# EAGLE design soundReactiveDotStarV1 (EAGLE 9.2.0)
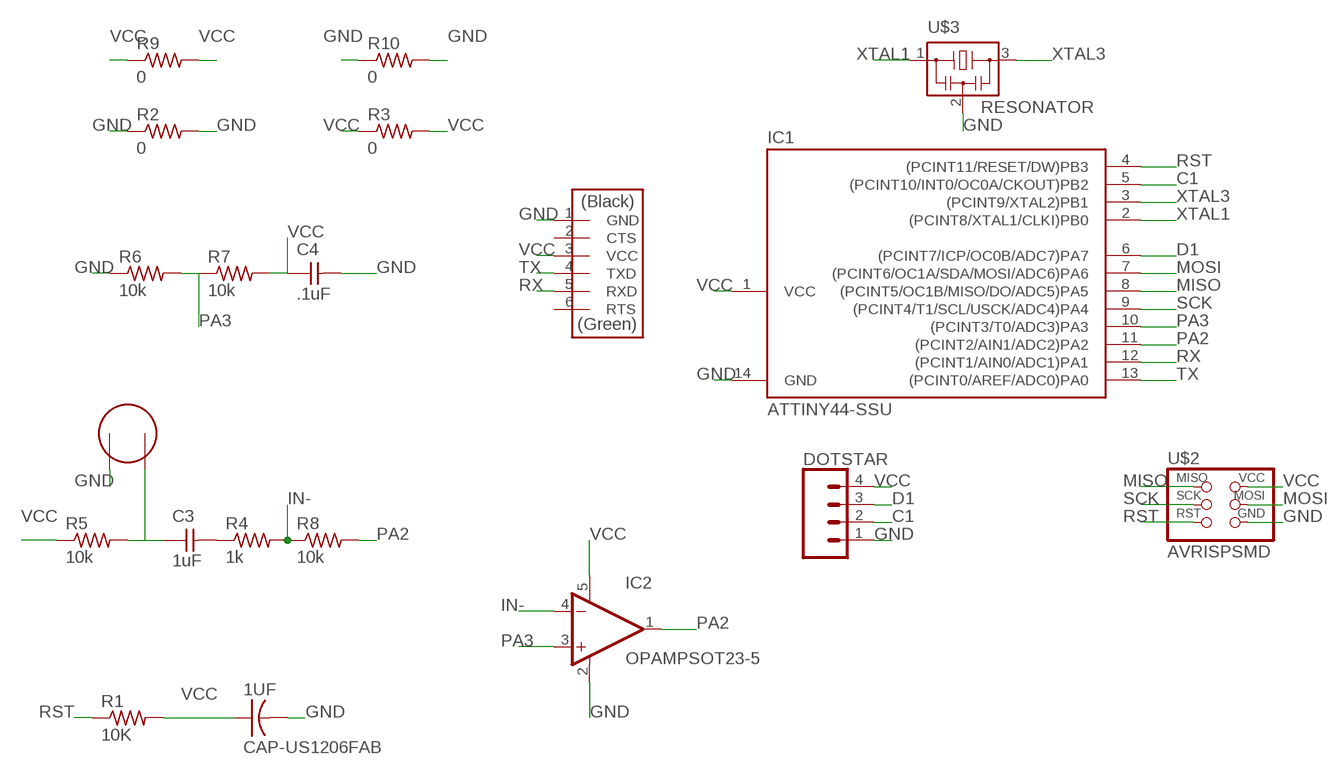
[diagram p0: schematic, sheet 1]

## Parts
1UF  CAP-US1206FAB  [C1206FAB]
C3  1uF  CAP-UNPOLARIZEDFAB  [C1206FAB]
C4  .1uF  CAP-UNPOLARIZEDFAB  [C1206FAB]
DOTSTAR  CONN_04SMD_RA_FEMALE  [1X04_SMD_RA_FEMALE]
IC1  ATTINY44-SSU  [SOIC14]
IC2  OPAMPSOT23-5  [SOT23-5]
R1  10K  RES-US1206FAB  [R1206FAB]
R2  0  RES-US1206FAB  [R1206FAB]
R3  0  RES-US1206FAB  [R1206FAB]
R4  1k  RES-US1206FAB  [R1206FAB]
R5  10k  RES-US1206FAB  [R1206FAB]
R6  10k  RES-US1206FAB  [R1206FAB]
R7  10k  RES-US1206FAB  [R1206FAB]
R8  10k  RES-US1206FAB  [R1206FAB]
R9  0  RES-US1206FAB  [R1206FAB]
R10  0  RES-US1206FAB  [R1206FAB]
U$1  FTDI-SMD-HEADER  [1X06SMD]
U$2  AVRISPSMD  [2X03SMD]
U$3  RESONATOR  [EFOBM]
U$4  ELECTRET  [ELECTRET_2742PBJ-A]

## Nets
C1: DOTSTAR.2 IC1.5((PCINT10/INT0/OC0A/CKOUT)PB2)
D1: DOTSTAR.3 IC1.6((PCINT7/ICP/OC0B/ADC7)PA7)
GND: 1UF.2 C4.2 DOTSTAR.1 IC1.14(GND) IC2.2(V-) R2.1 R2.2 R6.1 R10.1 R10.2 U$1.1(GND) U$2.6(GND) U$3.2 U$4.P$1
IN-: IC2.4(-IN) R4.2 R8.1
MISO: IC1.8((PCINT5/OC1B/MISO/DO/ADC5)PA5) U$2.1(MISO)
MOSI: IC1.7((PCINT6/OC1A/SDA/MOSI/ADC6)PA6) U$2.4(MOSI)
N$1: C3.1 R5.2 U$4.P$2
N$5: C3.2 R4.1
PA2: IC1.11((PCINT2/AIN1/ADC2)PA2) IC2.1(OUT) R8.2
PA3: IC1.10((PCINT3/T0/ADC3)PA3) IC2.3(+IN) R6.2 R7.1
RST: IC1.4((PCINT11/RESET/DW)PB3) R1.1 U$2.5(RST)
RX: IC1.12((PCINT1/AIN0/ADC1)PA1) U$1.5(RXD)
SCK: IC1.9((PCINT4/T1/SCL/USCK/ADC4)PA4) U$2.3(SCK)
TX: IC1.13((PCINT0/AREF/ADC0)PA0) U$1.4(TXD)
VCC: 1UF.1 C4.1 DOTSTAR.4 IC1.1(VCC) IC2.5(V+) R1.2 R3.1 R3.2 R5.1 R7.2 R9.1 R9.2 U$1.3(VCC) U$2.2(VCC)
XTAL1: IC1.2((PCINT8/XTAL1/CLKI)PB0) U$3.1
XTAL3: IC1.3((PCINT9/XTAL2)PB1) U$3.3
Unconnected: U$1.2(CTS) U$1.6(RTS)

## Library data of the parts
1UF = fab:CAP-US
C3 C4 = fab:CAP-UNPOLARIZED
DOTSTAR = SparkFun-Connectors:CONN_04: Multi connection point. Often used as Generic Header-pin footprint for 0.1 inch spaced/style header connections On any of the 0.1 inch spaced packages, you can populate with these: Break Away Headers - Straight <https://www.sparkfun.com/products/116> (PRT-00116) Break Away Male Headers - Right Angle <https://www.sparkfun.com/products/553> (PRT-00553) Female Headers <https://www.sparkfun.com/products/115> (PRT-00115) Break Away Headers - Machine Pin <https://www.sparkfun.com/products/117> (PRT-00117) Break Away Female Headers - Swiss Machine Pin <https://www.sparkfun.com/products/743> (PRT-00743) For SCREWTERMINALS and SPRING TERMINALS visit here: Screw Terimnals on SparkFun.com <https://www.sparkfun.com/search/results?term=Screw+Terminals> (5mm/3.5mm/2.54mm spacing) This device is also useful as a general connection point to wire up your design to another part of your project. Our various solder wires solder well into these plated through hole pads. Hook-Up Wire - Assortment (Stranded, 22 AWG) <https://www.sparkfun.com/products/11375> (PRT-11375) Hook-Up Wire - Assortment (Solid Core, 22 AWG) <https://www.sparkfun.com/products/11367> (PRT-11367) View the entire wire category on our website here <https://www.sparkfun.com/categories/141> Special notes: Molex polarized connector foot print use with SKU : PRT-08231 with associated crimp pins and housings. 1MM SMD Version SKU: PRT-10208; PROD_ID: CONN-12382
IC1 = fab:ATTINY44
IC2 = fab:OPAMP: Rail-to-Rail Operational Amplifiers Single-Supply, MicroAmplifier(TM) Series
R1-R10 = fab:RES-US: Resistor (US Symbol) Variants with postfix FAB are widened to allow the routing of internal traces
U$1 = fab:FTDI-SMD-HEADER
U$2 = fab:AVRISP
U$3 = fab:RESONATOR
U$4 = fab:ELECTRET

## Board
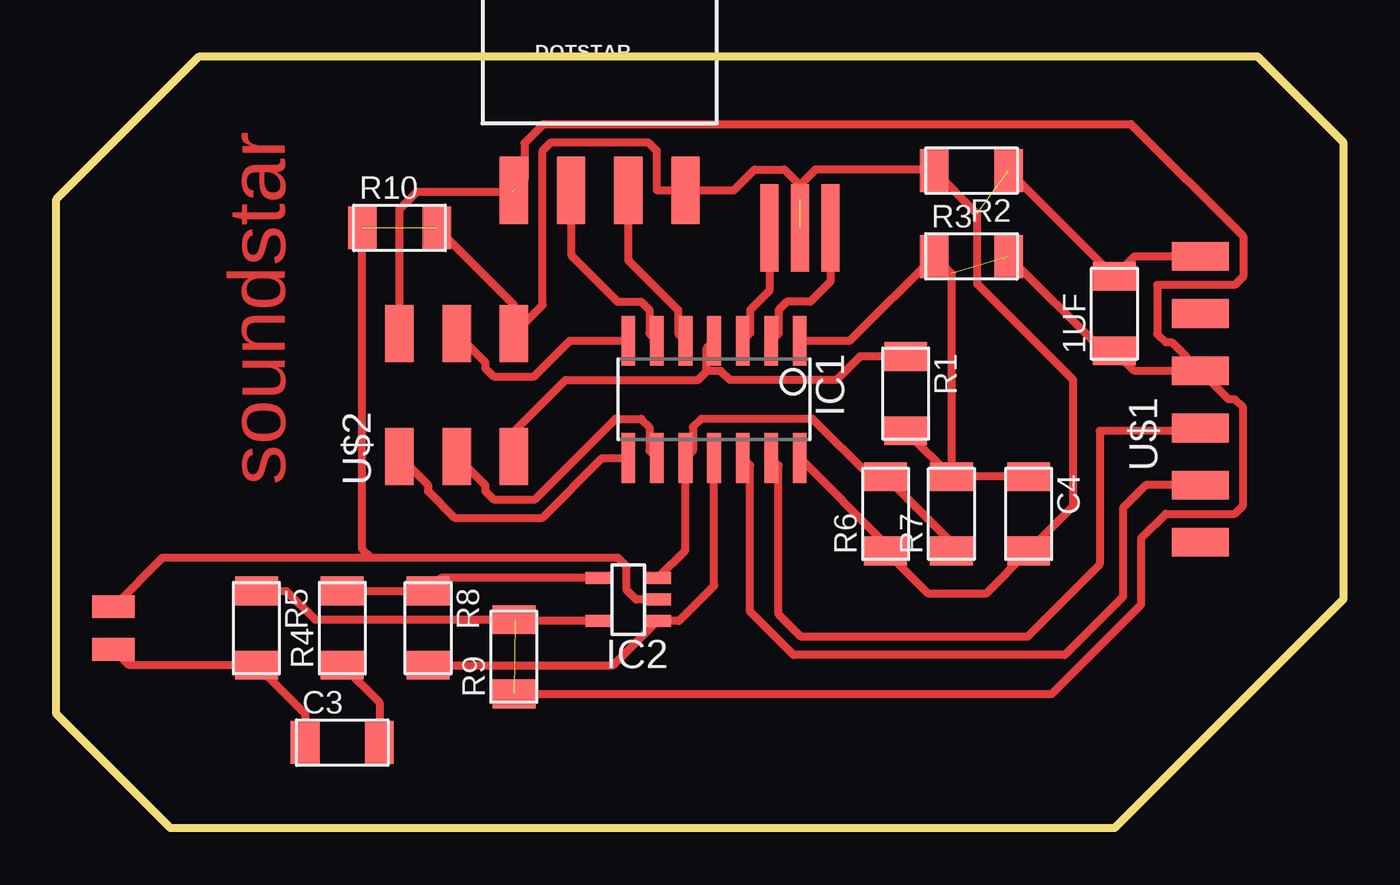
[diagram p1: board, top side]

Size 57.15 x 34.29 mm. Coordinates in mm from the lower left corner, seen from the top.
Outline: 6.35,34.29 53.34,34.29 57.15,30.48 57.15,10.16 46.99,0 5.08,0 0,5.08 0,27.94 6.35,34.29
Copper layers (1*16): Top 0.035mm / dielectric 1.5mm / Bottom 0.035mm
Design rules "goodDRelenack": minimum track width 14mil, minimum drill 32mil, track to track 18mil, track to pad 18mil, pad to pad 18mil, via to via 18mil, smd to smd 18mil, copper to edge 16mil, drill to drill 16mil, minimum pad ring 10mil, minimum via ring 8mil, stop-mask expansion 4mil, vias tented up to drill 0mil, thermal gap 16mil

### Footprints (pad centres in the part's own frame; a part is rotated, then mirrored left to right if it is on the bottom)
C1206FAB = smd 1.27 x 1.905: 1 -1.651,0; 2 1.651,0
1X04_SMD_RA_FEMALE = smd 1.25 x 3: 1 -3.81,7.225; 2 -1.27,7.225; 3 1.27,7.225; 4 3.81,7.225
SOIC14 = smd 0.61 x 2.21: 1 -3.81,-2.603; 2 -2.54,-2.603; 3 -1.27,-2.603; 4 0,-2.603; 5 1.27,-2.603; 6 2.54,-2.603; 7 3.81,-2.603; 8 3.81,2.603; 9 2.54,2.603; 10 1.27,2.603; 11 0,2.603; 12 -1.27,2.603; 13 -2.54,2.603; 14 -3.81,2.603
SOT23-5 = smd 0.533 x 1.194: 1 -0.95,-1.306; 2 0,-1.306; 3 0.95,-1.306; 4 0.95,1.306; 5 -0.95,1.306
R1206FAB = smd 1.27 x 1.905: 1 -1.651,0; 2 1.651,0
1X06SMD = smd 2.54 x 1.27: 1 0,6.35; 2 0,3.81; 3 0,1.27; 4 0,-1.27; 5 0,-3.81; 6 0,-6.35
2X03SMD = smd 2.54 x 1.27: 1 -2.54,2.54; 2 2.92,2.54; 3 -2.54,0; 4 2.92,0; 5 -2.54,-2.54; 6 2.92,-2.54
EFOBM = smd 0.8 x 3.9: 1 -1.35,0; 2 0,0; 3 1.35,0
ELECTRET_2742PBJ-A = smd 1.016 x 1.905: P$1 -0.953,0; P$2 0.953,0

### Placement (x,y rotation side)
1UF  46.99,22.86 90 top
C3  12.7,3.81 0 top
C4  43.18,13.97 270 top
DOTSTAR  24.13,35.56 180 top
IC1  29.21,19.05 180 top
IC2  25.4,10.16 90 top
R1  37.72,19.3 270 top
R2  40.64,29.21 180 top
R3  40.64,25.4 0 top
R4  12.7,8.89 90 top
R5  8.89,8.89 270 top
R6  36.83,13.97 90 top
R7  39.75,13.97 90 top
R8  16.51,8.89 270 top
R9  20.32,7.62 90 top
R10  15.24,26.67 0 top
U$1  50.8,19.05 0 top
U$2  17.78,19.05 90 top
U$3  33.02,26.67 180 top
U$4  2.54,8.89 270 top

### Tracks (layer width: path | path; a pad name or v marks a point on that pad's centre or on a via)
C1
  Top 0.356: IC1.5 27.61,21.98 27.61,23.02 25.4,25.23 DOTSTAR.2
D1
  Top 0.356: DOTSTAR.3 22.86,25.46 24.93,23.39 25.97,23.39 26.34,23.02 26.34,21.98 IC1.6
GND  (3 unrouted)
  Top 0.356: 1UF.2 46.54,24.51 | 1UF.2 47.88,25.4 U$1.1 | 1UF.2 R2.1 | IC1.14 36.83,12.64 R6.1 38.73,10.41 41.27,10.41 C4.2 45.15,14.29 45.15,15.49 45.15,19.93 40.89,24.18 40.89,27.3 R2.2 38.94,29.25 34.29,29.25 33.71,29.25 33.02,28.57 | 26.66,10.21 IC2.2 25.75,10.16 25.33,10.58 25.33,11.64 24.95,12.01 13.97,12.01 | 13.97,12.01 4.71,12.01 U$4.P$1 | R10.2 20.32,23.24 U$2.6 21.6,23.25 21.6,30.1 21.97,30.47 26.29,30.47 26.66,30.1 26.66,28.36 26.68,28.33 DOTSTAR.1 30.09,28.33 31.01,29.25 32.33,29.25 33.02,28.57 | 13.97,12.01 13.59,12.39 R10.1 | 33.02,28.57 33.02,27.94
IN-
  Top 0.356: R4.2 R8.1 17.08,11.11 IC2.4
MISO
  Top 0.356: IC1.8 24.24,16.45 21.59,13.79 17.7,13.79 16.51,14.98 16.51,15.24 U$2.1
MOSI
  Top 0.356: IC1.7 22.81,21.65 21.22,20.06 19.42,20.06 19.05,20.44 19.05,20.7 U$2.4
N$1
  Top 0.356: C3.1 11.05,5.08 R5.2 3.24,7.24 U$4.P$2
N$5
  Top 0.356: R4.1 14.35,5.59 C3.2
PA2
  Top 0.356: R8.2 24.73,7.24 IC2.1 27.65,9.21 29.21,10.77 IC1.11
PA3
  Top 0.356: IC2.3 27.94,12.34 IC1.10 28.27,16.78 28.27,17.81 28.64,18.19 33.59,18.19 36.15,15.62 R6.2 39.75,12.7 R7.1
RST
  Top 0.356: U$2.5 20.23,16.59 20.23,17.53 22.62,19.91 28.51,19.91 28.88,20.29 28.88,20.32 | 28.88,20.32 28.88,21.32 IC1.4 | R1.1 35.69,20.95 34.65,19.91 29.91,19.91 29.51,20.32 28.88,20.32
RX
  Top 0.356: IC1.12 30.81,16.12 30.81,9.62 32.74,7.7 44.79,7.7 47.37,10.28 47.37,14.22 48.39,15.24 U$1.5
SCK
  Top 0.356: U$2.3 19.05,15.24 19.05,14.98 19.42,14.6 21.25,14.6 24.83,18.19 25.97,18.19 26.34,17.81 26.34,16.78 IC1.9
TX
  Top 0.356: U$1.4 50.67,17.65 46.34,17.65 46.34,11.73 43.13,8.51 33.07,8.51 32.08,9.5 32.08,16.12 IC1.13
VCC  (3 unrouted)
  Top 0.356: U$1.3 47.88,20.32 1UF.1 46.48,21.21 R3.2 | IC1.1 35.24,21.65 R3.1 39.75,24.64 R7.2 | U$1.3 49.53,21.59 49.27,21.59 48.9,21.96 48.9,24.13 52.33,24.13 52.7,24.5 52.7,26.3 47.72,31.28 21.63,31.28 20.79,30.43 20.79,28.8 20.24,28.26 15.99,28.26 15.24,27.5 U$2.2 | C4.1 R7.2 | R1.2 R7.2 | 24.03,9.27 IC2.5 20.38,9.21 R9.2 11.48,9.27 10.21,10.54 R5.1 | U$1.3 52.07,19.05 52.33,19.05 52.7,18.68 52.7,14.34 52.33,13.97 49.27,13.97 48.18,12.89 48.18,9.94 44.21,5.97 R9.1
XTAL1
  Top 0.356: U$3.1 34.37,24.27 33.49,23.39 32.45,23.39 32.08,23.02 32.08,21.98 IC1.2
XTAL3
  Top 0.356: IC1.3 30.81,21.98 30.81,23.02 31.67,23.88 U$3.3

### Text on the board
Top: soundstar